# EAGLE design PCB-Rpi (EAGLE 9.5.2)
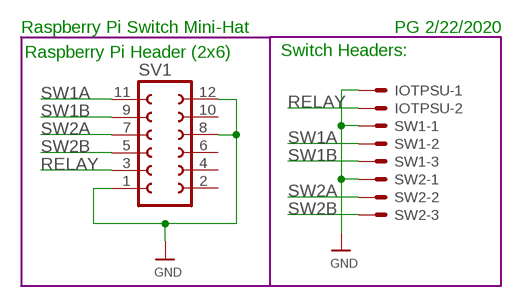
[diagram p0: schematic, sheet 1]

## Parts
IOTPSU  KK-156-2  [KK-156-2]
SV1  FE06-2  [FE06-2]
SW1  KK-156-3  [KK-156-3]
SW2  KK-156-3  [KK-156-3]

## Nets
GND: IOTPSU.1 SV1.1 SV1.8 SV1.12 SW1.1 SW2.1
RELAY: IOTPSU.2 SV1.3
SW1A: SV1.11 SW1.2
SW1B: SV1.9 SW1.3
SW2A: SV1.7 SW2.2
SW2B: SV1.5 SW2.3
Unconnected: SV1.2 SV1.4 SV1.6 SV1.10

## Notes on the sheet
- Raspberry Pi Switch Mini-Hat | PG 2/22/2020
- Raspberry Pi Header (2x6) | Switch Headers:

## Library data of the parts
IOTPSU = con-molex:KK-156-2: KK 156 HEADER Source: http://www.molex.com/pdm_docs/sd/026604100_sd.pdf; MF: MOLEX; OC_FARNELL: unknown; OC_NEWARK: unknown
SV1 = con-lsta:FE06-2: FEMALE HEADER; OC_FARNELL: unknown; OC_NEWARK: unknown
SW1 SW2 = con-molex:KK-156-3: KK 156 HEADER Source: http://www.molex.com/pdm_docs/sd/026604100_sd.pdf; MF: MOLEX; OC_FARNELL: unknown; OC_NEWARK: unknown

## Board
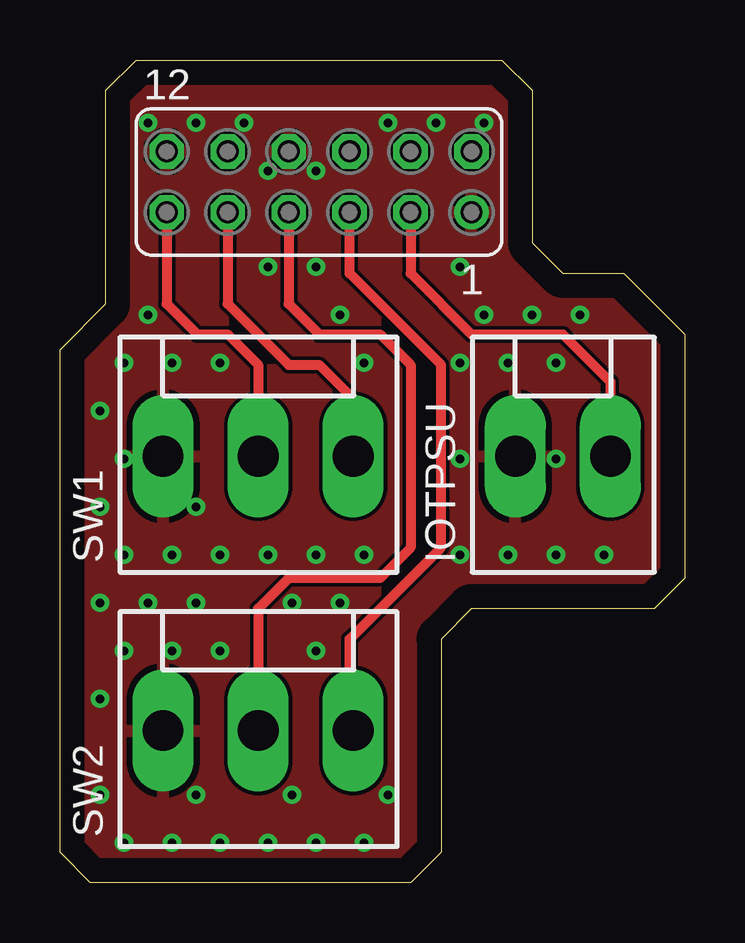
[diagram p1: board, top side]
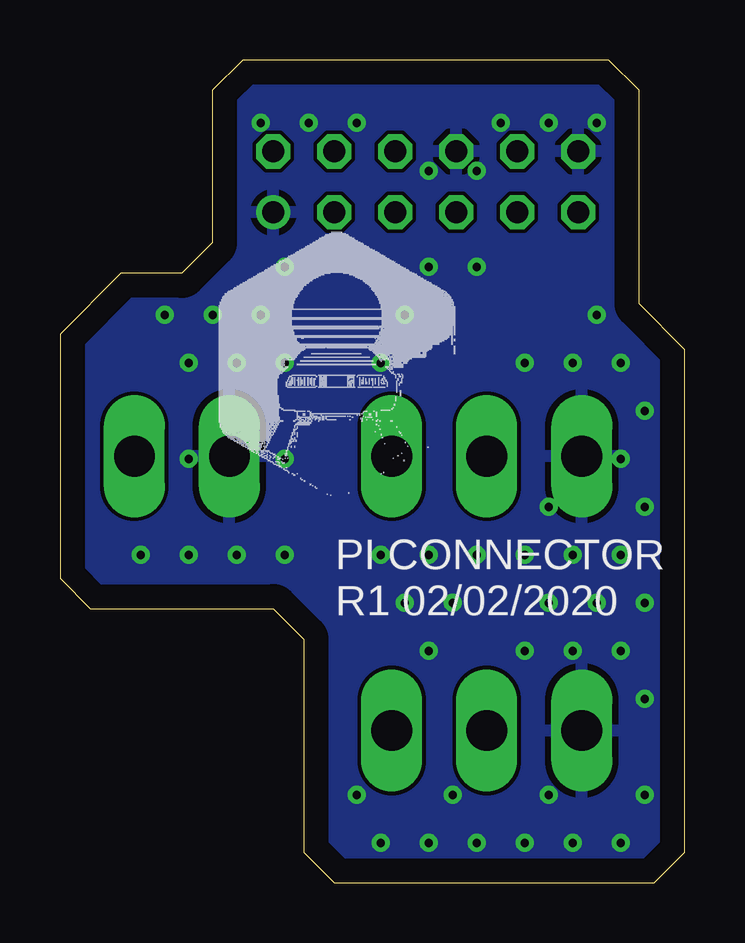
[diagram p2: board, bottom side, seen from below]

Size 26.04 x 34.29 mm. Coordinates in mm from the lower left corner, seen from the top.
Outline: 0,1.27 0,22.23 1.91,24.13 1.91,33.02 3.17,34.29 18.41,34.29 19.68,33.02 19.68,26.67 20.95,25.4 23.5,25.4 26.04,22.86 26.04,12.7 24.77,11.43 17.14,11.43 15.88,10.16 15.88,1.27 14.61,0 1.27,0 0,1.27
Copper layers (1*16): Top 0.035mm / dielectric 1.5mm / Bottom 0.035mm
Design rules "default": minimum track width 6mil, minimum drill 0.35mm, track to track 6mil, track to pad 6mil, pad to pad 6mil, via to via 6mil, smd to smd 6mil, copper to edge 40mil, drill to drill 6mil, minimum pad ring 10mil, minimum via ring 8mil, stop-mask expansion 4mil, vias tented up to drill 0.5mm, thermal gap 10mil

### Footprints (pad centres in the part's own frame; a part is rotated, then mirrored left to right if it is on the bottom)
KK-156-2 = drill 1.7 pad 2.184 long: 1 -1.98,0; 2 1.98,0
FE06-2 = drill 0.914: 1 -6.35,1.27 | drill 0.914 octagon: 2 -6.35,-1.27; 3 -3.81,1.27; 4 -3.81,-1.27; 5 -1.27,1.27; 6 -1.27,-1.27; 7 1.27,1.27; 8 1.27,-1.27; 9 3.81,1.27; 10 3.81,-1.27; 11 6.35,1.27; 12 6.35,-1.27
KK-156-3 = drill 1.7 pad 2.184 long: 1 -3.96,0; 2 0,0; 3 3.96,0

### Placement (x,y rotation side)
IOTPSU  20.95,17.78 0 top
SV1  10.79,29.21 180 top
SW1  8.26,17.78 0 top
SW2  8.26,6.35 0 top

### Tracks (layer width: path | path; a pad name or v marks a point on that pad's centre or on a via)
GND  (via drill 0.35)
  other vias: 2.67,1.67 1.67,3.67 1.67,7.67 2.67,9.67 1.67,11.67 2.67,13.67 1.67,15.67 2.67,17.67 1.67,19.67 2.67,21.67 4.67,1.67 4.67,9.67 3.67,11.67 4.67,13.67 4.67,21.67 3.67,23.67 3.67,31.67 6.67,1.67 5.67,3.67 6.67,9.67 5.67,11.67 6.67,13.67 5.67,15.67 6.67,21.67 5.67,31.67 8.67,1.67 8.67,13.67 8.67,25.67 8.67,29.67 7.67,31.67 10.67,1.67 9.67,3.67 10.67,9.67 9.67,11.67 10.67,13.67 10.67,25.67 10.67,29.67 12.67,1.67 11.67,11.67 12.67,13.67 12.67,21.67 11.67,23.67 13.67,3.67 13.67,31.67 16.67,13.67 16.67,17.67 16.67,21.67 16.67,25.67 15.67,31.67 18.67,13.67 18.67,21.67 17.67,23.67 17.67,31.67 20.67,13.67 20.67,17.67 20.67,21.67 19.67,23.67 22.67,13.67 21.67,23.67
  pour Top: 0,0 0,34.29 26.04,34.29 26.04,0
  pour Bottom: 0,0 0,34.29 26.04,34.29 26.04,0
RELAY
  Top 0.406: SV1.3 14.61,25.4 17.14,22.86 20.95,22.86 22.93,20.88 IOTPSU.2
SW1A
  Top 0.406: SW1.2 8.26,21.59 6.99,22.86 5.71,22.86 4.45,24.13 SV1.11
SW1B
  Top 0.406: SW1.3 12.21,20.17 10.79,21.59 9.53,21.59 6.99,24.13 SV1.9
SW2A
  Top 0.406: SV1.7 9.53,24.13 10.79,22.86 13.34,22.86 14.61,21.59 14.61,13.97 13.34,12.7 9.53,12.7 8.26,11.43 SW2.2
SW2B
  Top 0.406: SW2.3 12.06,6.5 12.06,10.16 15.88,13.97 15.88,21.59 12.06,25.4 SV1.5

### Text on the board
bPlace: PI CONNECTOR / R1 02/02/2020